# EAGLE design VCAFront (EAGLE 6.5.0)
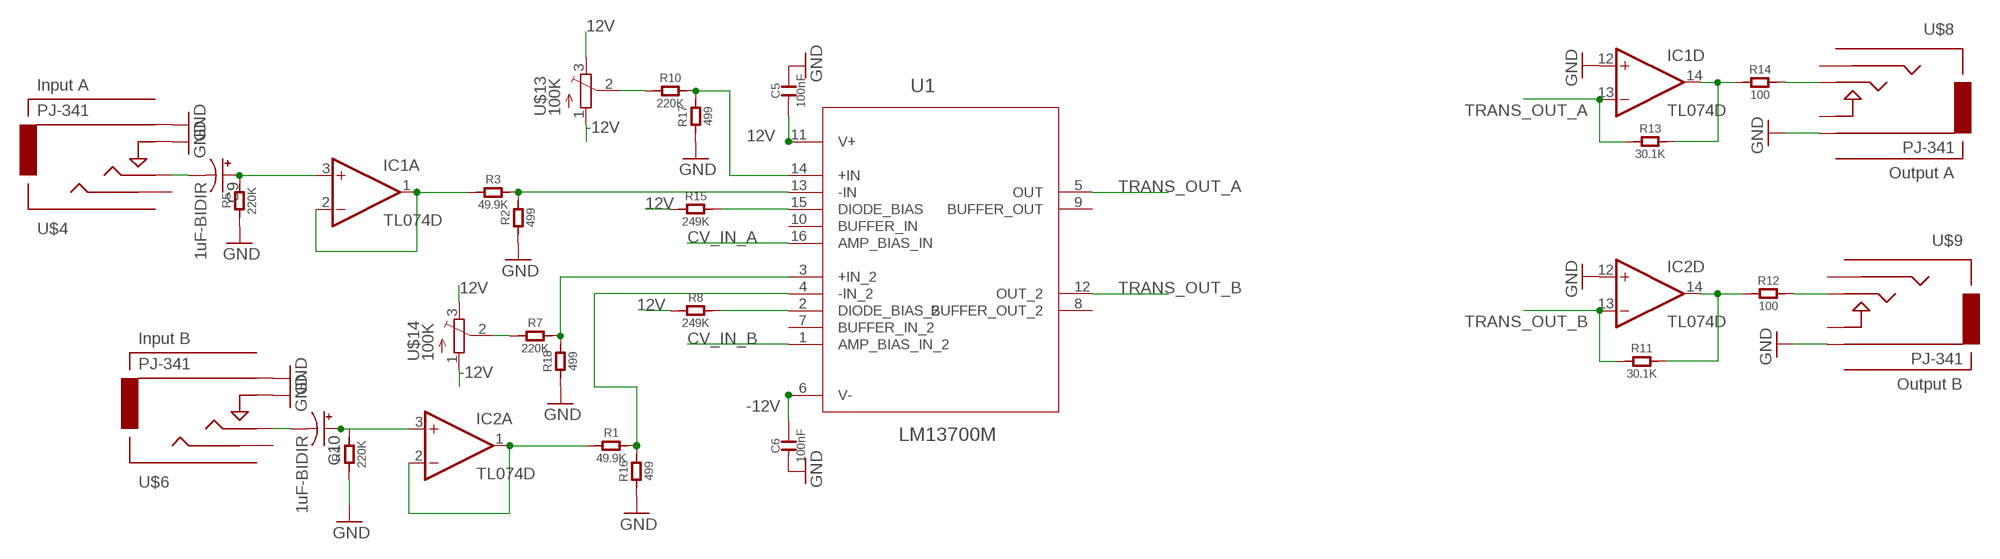
[diagram p0: schematic, sheet 1, part 1 of 2]
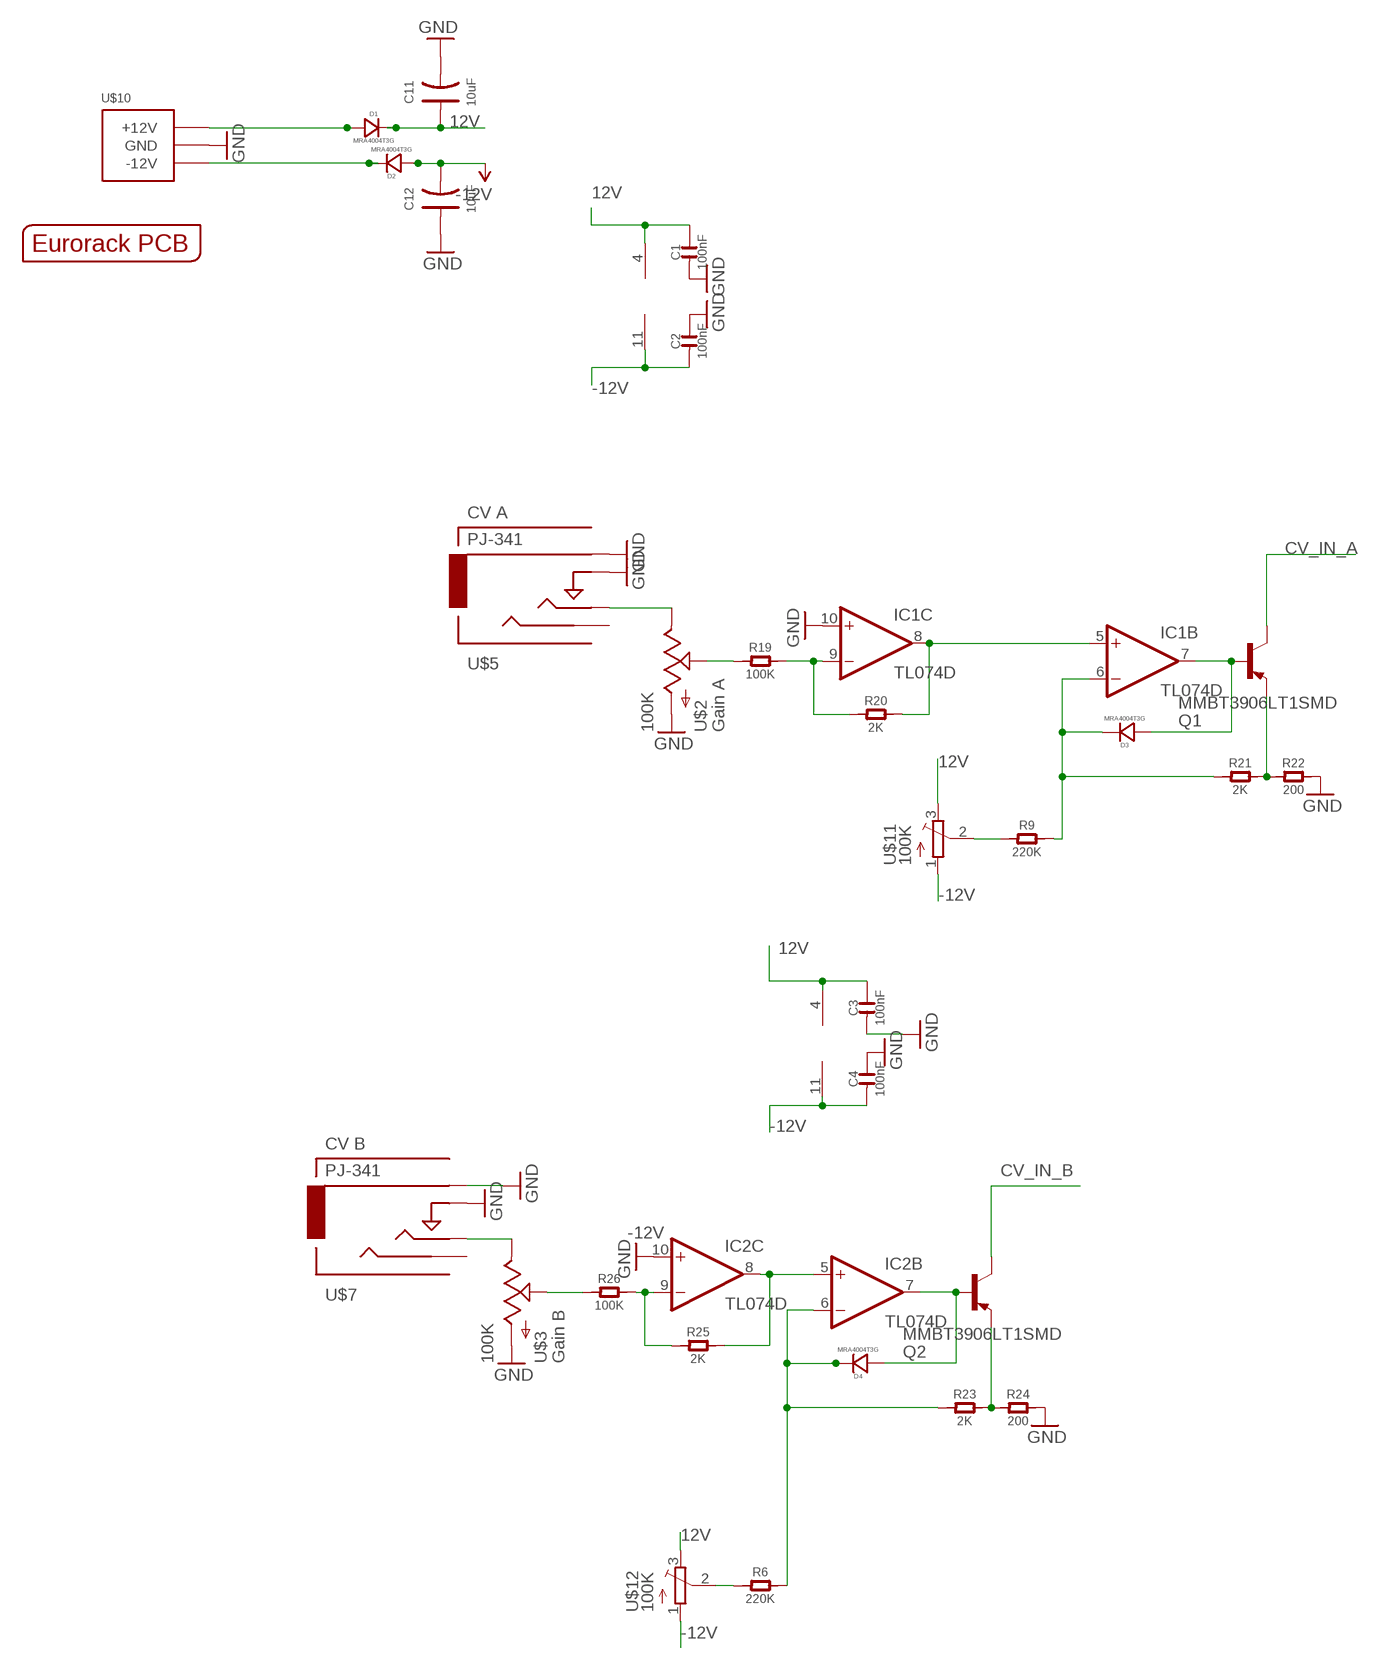
[diagram p1: schematic, sheet 1, part 2 of 2]

## Parts
C1  100nF  C-0603  [C0603]
C2  100nF  C-0603  [C0603]
C3  100nF  C-0603  [C0603]
C4  100nF  C-0603  [C0603]
C5  100nF  C-0603  [C0603]
C6  100nF  C-0603  [C0603]
C9  1uF-BIDIR  CPOL-US153CLV-0505  [153CLV-0505]
C10  1uF-BIDIR  CPOL-US153CLV-0505  [153CLV-0505]
C11  10uF  C-POLAR-A  [AVX-A]
C12  10uF  C-POLAR-A  [AVX-A]
D1  MRA4004T3G  D-SMA  [DO-214AC]
D2  MRA4004T3G  D-SMA  [DO-214AC]
D3  MRA4004T3G  D-SMA  [DO-214AC]
D4  MRA4004T3G  D-SMA  [DO-214AC]
IC1  TL074D  [SO14]
IC2  TL074D  [SO14]
Q1  MMBT3906LT1SMD  [SOT23-BEC]
Q2  MMBT3906LT1SMD  [SOT23-BEC]
R1  49.9K  R  [C0805]
R2  499  R  [C0805]
R3  49.9K  R  [C0805]
R4  220K  R  [C0805]
R5  220K  R  [C0805]
R6  220K  R  [C0805]
R7  220K  R  [C0805]
R8  249K  R  [C0805]
R9  220K  R  [C0805]
R10  220K  R  [C0805]
R11  30.1K  R  [C0805]
R12  100  R  [C0805]
R13  30.1K  R  [C0805]
R14  100  R  [C0805]
R15  249K  R  [C0805]
R16  499  R  [C0805]
R17  499  R  [C0805]
R18  499  R  [C0805]
R19  100K  R  [C0805]
R20  2K  R  [C0805]
R21  2K  R  [C0805]
R22  200  R  [C0805]
R23  2K  R  [C0805]
R24  200  R  [C0805]
R25  2K  R  [C0805]
R26  100K  R  [C0805]
U1  LM13700M  [SOIC127P620X175-16N]
U$1  EURORACK_PCB4HP  [EURORACK4HPPCB]
U$2  100K  POTZEPHPOT  [OG-POTS_ALPS_POT_VERTICAL]
U$3  100K  POTZEPHPOT  [OG-POTS_ALPS_POT_VERTICAL]
U$4  PJ-341  AUDIO-JACKINPUT  [3.5MM-JACK-SWITCH-13MM-INPUT]
U$5  PJ-341  AUDIO-JACKINPUT  [3.5MM-JACK-SWITCH-13MM-INPUT]
U$6  PJ-341  AUDIO-JACKINPUT  [3.5MM-JACK-SWITCH-13MM-INPUT]
U$7  PJ-341  AUDIO-JACKINPUT  [3.5MM-JACK-SWITCH-13MM-INPUT]
U$8  PJ-341  AUDIO-JACKOUTPUT  [3.5MM-JACK-SWITCH-13MM-OUTPUT]
U$9  PJ-341  AUDIO-JACKOUTPUT  [3.5MM-JACK-SWITCH-13MM-OUTPUT]
U$10  POWER_SIMPLE10  [POWER_10]
U$11  100K  TRIMPOTTC33X  [TC33X]
U$12  100K  TRIMPOTTC33X  [TC33X]
U$13  100K  TRIMPOTTC33X  [TC33X]
U$14  100K  TRIMPOTTC33X  [TC33X]

## Nets
12V: C1.2 C3.2 C5.1 C11.+ D1.2(-) IC1.4(P:V+) IC2.4(P:V+) R8.1 R15.1 U1.11(V+) U$11.3(E) U$12.3(E) U$13.3(E) U$14.3(E)
-12V: C2.1 C4.1 C6.2 C12.- D2.1(+) IC1.11(P:V-) IC2.11(P:V-) U1.6(V-) U$11.1(A) U$12.1(A) U$13.1(A) U$14.1(A)
CV_IN_A: Q1.C U1.16(AMP_BIAS_IN)
CV_IN_B: Q2.C U1.1(AMP_BIAS_IN_2)
GND: C1.1 C2.2 C3.1 C4.2 C5.2 C6.1 C11.- C12.+ IC1.10(C:+IN) IC1.12(D:+IN) IC2.10(C:+IN) IC2.12(D:+IN) R2.1 R4.1 R5.1 R16.1 R17.1 R18.1 R22.2 R24.2 U$2.P$3(A) U$3.P$3(A) U$4.RING@3(RING) U$4.SWITCH@3(SWITCH) U$5.RING@3(RING) U$5.SWITCH@3(SWITCH) U$6.RING@3(RING) U$6.SWITCH@3(SWITCH) U$7.RING@3(RING) U$7.SWITCH@3(SWITCH) U$8.RING@3(RING) U$9.RING@3(RING) U$10.3(GND) U$10.4(GND) U$10.5(GND) U$10.6(GND) U$10.7(GND) U$10.8(GND)
N$1: R14.2 U$8.TIP@3(TIP)
N$2: IC1.14(D:OUT) R13.2 R14.1
N$3: R8.2 U1.2(DIODE_BIAS_2)
N$4: R15.2 U1.15(DIODE_BIAS)
N$5: R12.2 U$9.TIP@3(TIP)
N$6: IC2.14(D:OUT) R11.2 R12.1
N$7: R19.1 U$2.P$2(S)
N$8: R10.1 U$13.2(S)
N$9: R9.1 U$11.2(S)
N$10: R7.1 U$14.2(S)
N$11: R6.1 U$12.2(S)
N$12: C9.- U$4.TIP@3(TIP)
N$13: C10.- U$6.TIP@3(TIP)
N$14: C9.+ IC1.3(A:+IN) R5.2
N$15: C10.+ IC2.3(A:+IN) R4.2
N$16: IC1.1(A:OUT) IC1.2(A:-IN) R3.1
N$18: IC2.1(A:OUT) IC2.2(A:-IN) R1.1
N$19: R2.2 R3.2 U1.13(-IN)
N$20: R1.2 R16.2 U1.4(-IN_2)
N$21: R10.2 R17.2 U1.14(+IN)
N$22: U$3.P$1(E) U$7.TIP@3(TIP)
N$23: R7.2 R18.2 U1.3(+IN_2)
N$24: U$2.P$1(E) U$5.TIP@3(TIP)
N$25: IC1.9(C:-IN) R19.2 R20.1
N$26: IC1.5(B:+IN) IC1.8(C:OUT) R20.2
N$27: D3.2(-) IC1.6(B:-IN) R9.2 R21.1
N$28 [heavypower]: D1.1(+) U$10.9(+12V) U$10.10(+12V)
N$29: D3.1(+) IC1.7(B:OUT) Q1.B
N$30: Q1.E R21.2 R22.1
N$32: D4.2(-) IC2.6(B:-IN) R6.2 R23.1
N$33: D4.1(+) IC2.7(B:OUT) Q2.B
N$34: Q2.E R23.2 R24.1
N$37: IC2.5(B:+IN) IC2.8(C:OUT) R25.2
N$38: R26.1 U$3.P$2(S)
N$39: IC2.9(C:-IN) R25.1 R26.2
N$64 [heavypower]: D2.2(-) U$10.1(-12V) U$10.2(-12V)
TRANS_OUT_A: IC1.13(D:-IN) R13.1 U1.5(OUT)
TRANS_OUT_B: IC2.13(D:-IN) R11.1 U1.12(OUT_2)
Unconnected: U1.7(BUFFER_IN_2) U1.8(BUFFER_OUT_2) U1.9(BUFFER_OUT) U1.10(BUFFER_IN) U$4.SECOND@3(SECOND) U$5.SECOND@3(SECOND) U$6.SECOND@3(SECOND) U$7.SECOND@3(SECOND) U$8.SECOND@3(SECOND) U$8.SWITCH@3(SWITCH) U$9.SECOND@3(SECOND) U$9.SWITCH@3(SWITCH)

## Library data of the parts
C1-C6 = OPL:C*
C9 C10 = adafruit:CPOL-US: POLARIZED CAPACITOR, American symbol
C11 C12 = OPL:C-POLAR*
D1-D4 = OPL:D*: DIODE; MF: VISHAY; MPN: US1G-E3/5AT; OC_FARNELL: 9551824
IC1 IC2 = EurorackModularParts:TL074: OP AMP
Q1 Q2 = transistor-pnp:MMBT3906*: PNP Transistror
R1-R26 = OPL:R*
U1 = FarnellThings:LM13700M: Dual Operational Transconductance Amplifiers; MPN: LM13700M; OC_FARNELL: 1468910; OC_NEWARK: 41K3505; PACKAGE: SOIC-16; SUPPLIER: National Semiconductor
U$1 = EurorackModularParts:EURORACK_PCB
U$2 = EurorackModularParts:POT; DESC: Gain A
U$3 = EurorackModularParts:POT; DESC: Gain B
U$4 = EurorackModularParts:AUDIO-JACK: Switching Mono 3.5mm Audio Jack from Erthenvar.; DESC: Input A; MPN: PJ-341
U$5 = EurorackModularParts:AUDIO-JACK: Switching Mono 3.5mm Audio Jack from Erthenvar.; DESC: CV A; MPN: PJ-341
U$6 = EurorackModularParts:AUDIO-JACK: Switching Mono 3.5mm Audio Jack from Erthenvar.; DESC: Input B; MPN: PJ-341
U$7 = EurorackModularParts:AUDIO-JACK: Switching Mono 3.5mm Audio Jack from Erthenvar.; DESC: CV B; MPN: PJ-341
U$8 = EurorackModularParts:AUDIO-JACK: Switching Mono 3.5mm Audio Jack from Erthenvar.; DESC: Output A; MPN: PJ-341
U$9 = EurorackModularParts:AUDIO-JACK: Switching Mono 3.5mm Audio Jack from Erthenvar.; DESC: Output B; MPN: PJ-341
U$10 = EurorackModularParts:POWER_SIMPLE
U$11-U$14 = adafruit:TRIMPOT: SMT trimmer potentiometer part number TC33X http://www.ladyada.net/library/eagle

## Net classes
0 default: width 0.305 mm
1 heavypower: width 0.381 mm

## Board
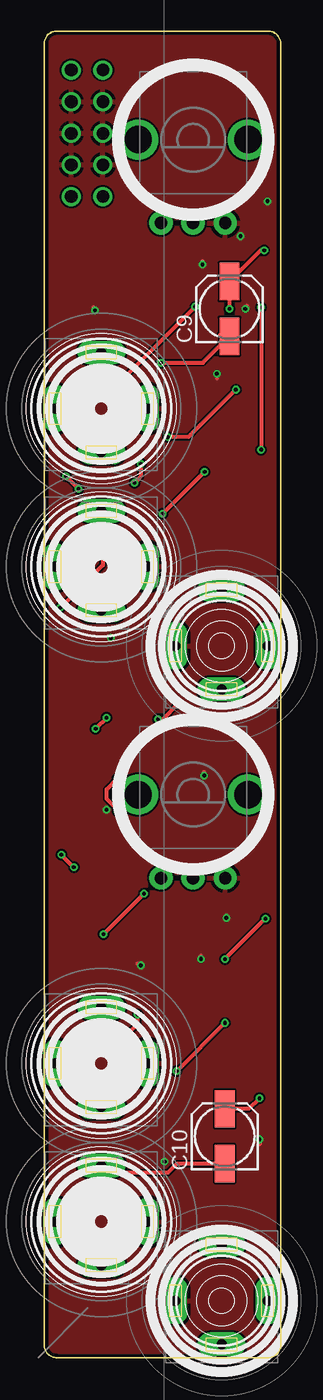
[diagram p2: board, top side]
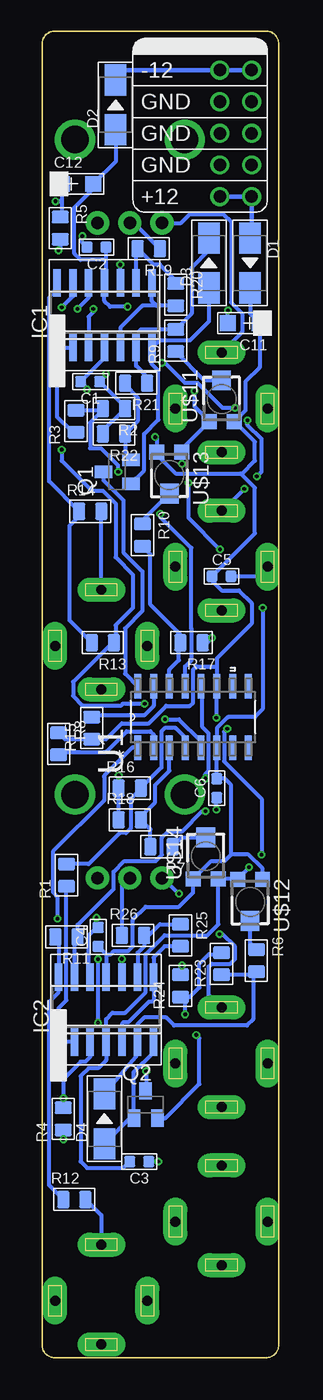
[diagram p3: board, bottom side, seen from below]

Size 18.98 x 106.5 mm. Coordinates in mm from the lower left corner, seen from the top.
Copper layers (1*16): Top 0.035mm / dielectric 1.5mm / Bottom 0.035mm
Design rules "ITEADstudio_DRC": minimum track width 6mil, minimum drill 12mil, track to track 6mil, track to pad 6mil, pad to pad 6mil, via to via 6mil, smd to smd 0mil, copper to edge 10mil, drill to drill 10mil, minimum pad ring 10mil, minimum via ring 6mil, stop-mask expansion 2mil, vias tented up to drill 100mil, thermal gap 10mil

### Footprints (pad centres in the part's own frame; a part is rotated, then mirrored left to right if it is on the bottom)
C0603 = smd 0.889 x 0.889: 1 -0.762,0; 2 0.762,0
153CLV-0505 = smd 3 x 1.6: + 2.2,0; - -2.2,0
AVX-A = smd 1.27 x 1.27: + -1.27,0; - 1.27,0
DO-214AC = smd 2.5 x 1.7: 1 -2,0; 2 2,0
SO14 = smd 0.6 x 2.2: 1 -3.81,-2.6; 2 -2.54,-2.6; 3 -1.27,-2.6; 4 0,-2.6; 5 1.27,-2.6; 6 2.54,-2.6; 7 3.81,-2.6; 8 3.81,2.6; 9 2.54,2.6; 10 1.27,2.6; 11 0,2.6; 12 -1.27,2.6; 13 -2.54,2.6; 14 -3.81,2.6
SOT23-BEC = smd 1 x 1.4: B -0.95,-1.1; C 0,1.1; E 0.95,-1.1
C0805 = smd 1.016 x 1.397: 1 -0.889,0; 2 0.889,0
SOIC127P620X175-16N = smd 1.981 x 0.559: 1 -2.464,4.445; 2 -2.464,3.175; 3 -2.464,1.905; 4 -2.464,0.635; 5 -2.464,-0.635; 6 -2.464,-1.905; 7 -2.464,-3.175; 8 -2.464,-4.445; 9 2.464,-4.445; 10 2.464,-3.175; 11 2.464,-1.905; 12 2.464,-0.635; 13 2.464,0.635; 14 2.464,1.905; 15 2.464,3.175; 16 2.464,4.445
OG-POTS_ALPS_POT_VERTICAL = drill 1 pad 1.88: P$1 -2.58,-6.7; P$2 0,-6.7; P$3 2.58,-6.7 | drill 2.2 pad 3.175: P$4 4.4,0; P$5 -4.4,0
3.5MM-JACK-SWITCH-13MM-INPUT = drill 0.8 pad 1.93 long: RING@3 -3.7,0; SECOND@3 0,-3.5; SWITCH@3 3.7,0; TIP@3 0,4.5
3.5MM-JACK-SWITCH-13MM-OUTPUT = drill 0.8 pad 1.93 long: RING@3 -3.7,0; SECOND@3 0,-3.5; SWITCH@3 3.7,0; TIP@3 0,4.5
POWER_10 = drill 1.016: 1 -5.08,-1.27; 2 -5.08,1.27; 3 -2.54,-1.27; 4 -2.54,1.27; 5 0,-1.27; 6 0,1.27; 7 2.54,-1.27; 8 2.54,1.27; 9 5.08,-1.27; 10 5.08,1.27
TC33X = smd 1.2 x 1.2: 1 -1,-1.825; 3 1,-1.825 | smd 1.5 x 1.6: 2 0,1.5

### Placement (x,y rotation side)
C1  15.12,78.36 180 bottom
C2  14.61,89.15 180 bottom
C3  11.18,15.75 180 bottom
C4  14.49,33.78 90 bottom
C5  4.58,62.74 0 bottom
C6  4.96,45.72 90 bottom
C9  14.87,84.2 90 top
C10  14.49,17.78 90 top
C11  2.8,83.06 180 bottom
C12  16.14,94.23 0 bottom
D1  2.29,87.88 270 bottom
D2  13.09,100.58 90 bottom
D3  5.6,87.88 90 bottom
D4  13.98,19.18 90 bottom
IC1  13.98,83.69 0 bottom
IC2  13.85,27.94 0 bottom
Q1  12.96,71.12 90 bottom
Q2  10.68,20.32 0 bottom
R1  17.03,38.73 90 bottom
R2  13.22,76.2 180 bottom
R3  16.26,75.18 90 bottom
R4  17.28,19.18 90 bottom
R5  17.53,90.68 270 bottom
R6  1.79,31.88 270 bottom
R7  9.41,41.02 180 bottom
R8  17.66,49.28 270 bottom
R9  8.26,81.66 90 bottom
R10  10.93,66.04 270 bottom
R11  17.03,33.78 180 bottom
R12  16.39,12.7 0 bottom
R13  14.11,57.4 180 bottom
R14  15.12,67.94 0 bottom
R15  14.99,50.55 90 bottom
R16  11.95,45.72 0 bottom
R17  6.99,57.4 180 bottom
R18  11.95,43.18 0 bottom
R19  10.42,89.03 180 bottom
R20  8.26,85.34 270 bottom
R21  11.44,78.23 180 bottom
R22  13.22,74.17 180 bottom
R23  4.58,31.62 90 bottom
R24  7.88,29.84 90 bottom
R25  7.88,33.91 270 bottom
R26  11.69,33.91 0 bottom
U1  6.87,51.44 90 bottom
U$1  -0.5,0 0 top
U$2  11.95,97.79 0 top
U$3  11.95,45.21 0 top
U$4  4.58,63.5 0 top
U$5  4.58,76.2 0 top
U$6  4.58,10.92 0 top
U$7  4.58,23.62 0 top
U$8  14.23,57.15 0 top
U$9  14.23,4.57 0 top
U$10  3.44,98.3 270 bottom
U$11  4.58,76.96 0 bottom
U$12  2.29,36.58 180 bottom
U$13  8.77,70.87 180 bottom
U$14  5.85,40.26 0 bottom

### Tracks (layer width: path | path; a pad name or v marks a point on that pad's centre or on a via)
12V  (via drill 0.3)
  Top 0.305: v15.38,77.72 11.56,73.91 v9.91,73.91 | v1.38,40.38 v2.38,39.38 | v5,51.38 v4.12,50.5
  Bottom 0.305: D1.2 2.29,83.82 C11.+ 1.53,79.5 2.67,78.36 2.67,76.04 U$11.3 3.52,75.14 1.91,73.53 1.91,72.01 2.93,70.99 3.06,70.99 | 4.96,55.5 4.96,56.13 2.17,58.93 2.17,60.58 3.18,61.59 4.58,61.59 5.34,62.36 C5.1 1.91,66.17 1.91,69.85 3.06,70.99 | 4.96,55.5 U1.11 5,53.75 v5,51.38 | R8.1 17.15,49.66 R15.1 13.85,49.66 12.58,50.93 10.42,50.93 9.03,52.32 7.12,52.32 6.87,52.58 6.87,55.24 6.61,55.5 4.96,55.5 | IC1.4 14.11,80.97 14.11,80.14 C1.2 15.38,77.85 v15.38,77.72 | C3.2 12.45,15.24 15.38,15.24 15.88,15.75 15.88,22.61 15.25,23.24 14.49,23.24 13.85,23.88 IC2.4 13.85,27.18 13.34,27.69 12.33,27.69 10.68,29.34 10.68,32.38 9.15,33.91 5.72,33.91 4.83,34.8 4.83,38.42 U$14.3 3.33,38.43 U$12.3 3.25,38.5 v2.38,39.38 | v9.91,73.91 9.77,73.77 U$13.3 9.77,72.5 8.26,70.99 3.06,70.99 | v1.38,40.38 1.38,44.88 4.38,47.88 4.38,50.25 v4.12,50.5
-12V  (via drill 0.3)
  Top 0.305: v4.71,64.9 4.71,63.63 v1.28,60.2 | v7.76,71.75 7.76,70.74 v7.25,70.23 | v12.12,84.38 6.75,79.01 v6.75,77.62
  Bottom 0.305: D2.1 13.09,96.01 C12.- 14.87,93.85 16.39,92.33 16.39,88.65 15.88,88.14 13.98,88.14 13.85,88.01 | C4.1 13.85,32.38 | 13.85,32.38 IC2.11 | 3.82,40.39 4.33,39.88 5.41,39.88 U$14.1 6.87,38.42 6.87,37.34 8.01,36.2 10.68,36.2 11.69,35.18 11.69,33.02 12.07,32.64 13.22,32.64 13.47,32.38 13.85,32.38 | 3.82,40.39 3.82,45.97 4.33,46.48 C6.2 U1.6 4.96,50.55 4.07,51.44 1.91,51.44 1.28,52.07 v1.28,60.2 | IC1.11 13.85,86.42 13.85,88.01 | 13.85,88.01 C2.1 | U$12.1 1.29,39.26 2.42,40.39 3.82,40.39 | v7.76,71.75 7.77,71.77 U$13.1 7.77,72.95 U$11.1 5.62,75.25 6.75,76.38 v6.75,77.62 | v7.25,70.23 7.25,67.44 v4.71,64.9 | 13.88,85.5 13.88,86.25 IC1.11 | v12.12,84.38 13.52,84.38 13.98,84.84 IC1.11
CV_IN_A
  Bottom 0.305: Q1.C 14.06,70.44 12.45,68.83 12.45,64.64 10.93,63.12 10.93,59.94 12.33,58.55 12.33,54.91 U1.16
CV_IN_B  (via drill 0.3)
  Top 0.305: v14.5,26.88 v10.62,23 | v17.75,35.25 v14.5,32
  Bottom 0.305: U1.1 11.74,48.97 13.98,46.74 14,46.62 14,44.75 18.12,40.62 18.12,37.38 17.75,37 v17.75,35.25 | v10.62,23 10.62,21.5 Q2.C | v14.5,32 v14.5,26.88
GND  (via drill 0.3)
  Top 0.305: v4.07,84.07 4.07,84.2 3.95,84.33 | v17.91,92.84 18.04,92.84 | v15.76,90.04 15.76,90.17 | v16.14,84.2 16.14,84.33 16.26,84.45 | v12.71,87.76 12.71,88.01 | v17.28,17.53 17.28,17.14 | v9.66,15.75 9.53,15.88 | v7.76,31.5 7.63,31.5 7.5,31.62 | v14.61,35.31 14.49,35.31 | v12.58,32 12.58,32.26 | v13.85,78.99 13.85,78.61 | v12.84,46.74 12.84,46.99 | v5.34,57.78 5.21,57.78
  Bottom 0.305: C12.+ 17.41,92.71 | 17.41,92.71 17.41,91.69 R5.1 | C11.- v4.07,84.07 | R22.2 14.11,74.42 R2.1 12.33,76.33 C1.1 13.85,78.87 v13.85,78.99 | C5.2 1.64,62.74 U$4.RING@3 | IC2.12 15.25,30.67 15.25,33.91 14.61,34.54 | 14.61,34.54 C4.2 | 17.41,92.71 17.53,92.84 v17.91,92.84 | C2.2 15.76,89.53 v15.76,90.04 | IC1.12 15.25,85.09 v16.14,84.2 | IC1.10 v12.71,87.76 | R18.1 R16.1 v12.84,46.74 | R4.1 v17.28,17.53 | C3.1 v9.66,15.75 | R24.2 7.88,31.37 v7.76,31.5 | 14.61,34.54 v14.61,35.31 | IC2.10 v12.58,32 | v5,44 5,44.88 C6.1 | R17.1 5.72,57.4 v5.34,57.78
  pour Top: 19.57,106.68 -0.75,106.68 -0.5,0 19.82,0
N$1
  Bottom 0.305: U$8.TIP@3 R14.2
N$2
  Bottom 0.305: R13.2 16.77,59.18 16.77,66.8 16.01,67.56 R14.1 18.42,70.36 18.42,85.09 17.79,85.85 IC1.14
N$3
  Bottom 0.305: R8.2 17.41,48.64 13.85,48.64 12.2,50.29 10.29,50.29 10.04,50.04 U1.2
N$4
  Bottom 0.305: U1.15 10.04,52.32 10.8,51.56 14.99,51.56 R15.2
N$5
  Bottom 0.305: R12.2 14.23,11.43 U$9.TIP@3
N$6
  Bottom 0.305: R11.2 17.66,33.53 IC2.14 17.66,29.34 18.42,28.57 18.42,13.84 R12.1
N$7
  Bottom 0.305: R19.1 11.18,90.68 11.53,90.68 U$2.P$2
N$8
  Bottom 0.305: U$13.2 10.93,67.21 R10.1
N$9
  Bottom 0.305: U$11.2 5.95,78.46 R9.1
N$10
  Bottom 0.305: R7.1 7.78,41.76 U$14.2
N$11
  Bottom 0.305: R6.1 2.29,33.27 U$12.2
N$12  (via drill 0.3)
  Top 0.305: 14.12,82.12 14.75,82.12 C9.- 12.74,79.88 v9.38,79.88 | v2.5,75.25 v3.5,76.25 | v2.75,69.75 v1.75,70.75
  Bottom 0.305: v9.38,79.88 9.12,79.88 7.5,78.25 6.5,78.25 4.5,76.25 v3.5,76.25 | v2.5,75.25 2.5,74.88 1.38,73.75 1.38,71.12 v1.75,70.75 | v2.75,69.75 4.5,68 U$4.TIP@3
N$13
  Top 0.305: C10.- 10.63,15.58 9.91,14.86 5.14,14.86 U$6.TIP@3
N$14  (via drill 0.3)
  Top 0.305: v17.66,88.9 17.37,88.9 C9.+ v14.87,84.2
  Bottom 0.305: R5.2 17.53,89.03 v17.66,88.9 | v14.87,84.2 14.87,83.95 15.25,83.57 IC1.3
N$15  (via drill 0.3)
  Top 0.305: v17.28,20.83 16.43,19.98 C10.+
  Bottom 0.305: IC2.3 15.12,24.13 15.5,23.75 15.88,23.75 17.28,22.35 v17.28,20.83 R4.2
N$16
  Bottom 0.305: IC1.2 IC1.1 17.79,75.56 16.52,74.3 R3.1
N$18
  Bottom 0.305: IC2.2 IC2.1 17.66,28.07 17.03,28.7 R1.1
N$19  (via drill 0.3)
  Top 0.305: v9.5,67.75 v12.88,71.12
  Bottom 0.305: R3.2 14.23,76.07 R2.2 14.11,76.07 15.12,75.06 15.12,73.03 15,73 14.25,73 12.88,71.62 v12.88,71.12 | U1.13 7.5,55.5 6.99,56.01 6.99,58.42 7,58.5 7,65 9.5,67.5 v9.5,67.75
N$20
  Bottom 0.305: U1.4 7.5,49.78 8.26,50.55 9.15,50.55 9.41,50.29 9.41,47.37 R16.2 11.12,45.62 11.88,44.88 11.88,42.5 12.25,42.12 12.75,42.12 15.25,39.62 17,39.62 R1.2
N$21
  Bottom 0.305: U1.14 8.77,55.24 8.01,56.01 8.01,57.28 R17.2 7.88,58.04 10.29,60.45 10.29,64.52 R10.2
N$22  (via drill 0.3)
  Top 0.305: v8,37.25 v4.75,34
  Bottom 0.305: v8,37.25 9.25,38.5 U$3.P$1 | v4.75,34 4.5,34 3.5,33 3.5,32 3.88,31.62 5.38,31.62 5.62,31.38 5.62,29.12 4.62,28.12 U$7.TIP@3
N$23
  Bottom 0.305: R7.2 10.29,42.42 R18.2 11.06,43.43 9.91,44.58 9.91,45.97 8.77,47.12 U1.3
N$24
  Bottom 0.305: U$2.P$1 7.85,91.09 7.12,91.82 4.45,91.82 3.82,91.19 3.82,84.71 2.93,83.82 2.93,82.35 U$5.TIP@3
N$25
  Bottom 0.305: R20.1 8.26,86.49 9.53,87.76 10.04,87.76 R19.2 11.44,88.9 IC1.9
N$26
  Bottom 0.305: R20.2 9.79,84.45 | 9.79,84.45 10.17,84.84 IC1.8 | 9.79,84.45 10.93,84.45 12.71,82.68 IC1.5
N$27
  Bottom 0.305: D3.2 5.6,88.9 6.99,87.5 6.99,83.82 R9.2 11.06,82.55 11.31,82.3 11.31,81.22 IC1.6 11.44,79.63 10.55,78.74 R21.1
N$28
  Bottom 0.381: U$10.9 U$10.10 2.17,90.01 D1.1
N$29
  Bottom 0.305: D3.1 5.6,83.19 7.12,81.66 9.6,81.66 IC1.7 10.17,79.76 9.66,79.25 9.66,75.31 10.8,74.17 10.8,71.23 Q1.B
N$30
  Bottom 0.305: R21.2 12.33,78.11 11.31,77.09 11.31,75.18 R22.1 12.33,72.53 Q1.E
N$32
  Bottom 0.305: R6.2 2.04,30.73 | 2.04,30.73 R23.1 | 2.04,30.73 2.04,27.18 2.55,26.67 8.39,26.67 9.03,27.3 10.8,27.3 11.31,26.8 IC2.6 11.31,24.35 D4.2
N$33
  Bottom 0.305: D4.1 11.94,19.22 Q2.B 11.63,22.93 10.04,24.51 IC2.7
N$34  (via drill 0.3)
  Top 0.305: v6.61,25.91 7.5,26.8 v7.5,27.56
  Bottom 0.305: R23.2 4.71,32.38 5.6,32.38 6.36,31.62 6.36,29.72 7.12,28.96 R24.1 7.5,28.57 v7.5,27.56 | Q2.E 9.11,19.22 6.36,21.97 6.36,25.65 v6.61,25.91
N$37
  Bottom 0.305: R25.2 9.15,33.02 10.04,32.13 IC2.8 10.04,28.7 10.17,28.57 10.42,28.57 12.07,26.92 12.45,26.92 12.58,26.8 IC2.5
N$38
  Bottom 0.305: U$3.P$2 12.58,37.88 R26.1
N$39
  Bottom 0.305: 11.31,29.84 IC2.9 11.31,32.51 10.8,33.02 R26.2 10.42,33.91 9.53,34.8 R25.1
N$64
  Bottom 0.381: U$10.2 U$10.1 12.29,103.38 arc-90 D2.2
TRANS_OUT_A  (via drill 0.3)
  Top 0.305: v17.41,84.33 v17.41,72.9 | v9.12,51.25 9.5,51.25 v10.75,52.5
  Bottom 0.305: IC1.13 16.52,85.22 v17.41,84.33 | v17.41,72.9 17.41,72.01 14.99,69.6 14.11,69.6 13.09,68.58 13.09,64.26 11.69,62.87 11.69,60.2 13.09,58.8 13.09,57.53 R13.1 13.25,57.5 16.5,54.25 16.5,53.12 15.75,52.38 12.62,52.38 12.5,52.5 v10.75,52.5 | v9.12,51.25 8,51.25 6.25,49.5 6.25,49 U1.5
TRANS_OUT_B  (via drill 0.3)
  Top 0.305: v5.88,46.5 5,45.62 5,44.88 5.88,44 v5.88,43.88
  Bottom 0.305: IC2.13 16.39,33.53 R11.1 16.12,33.88 16.12,34.75 13.25,37.62 13.25,39 12.38,39.88 9.88,39.88 9.38,40.38 9.38,41.75 8.88,42.25 7.75,42.25 6.12,43.88 v5.88,43.88 | v5.88,46.5 5.88,46.88 5.62,47.12 5.62,50.12 6.12,50.62 6.12,53.88 U1.12